# Altium project AD8428_shield.PrjPcb
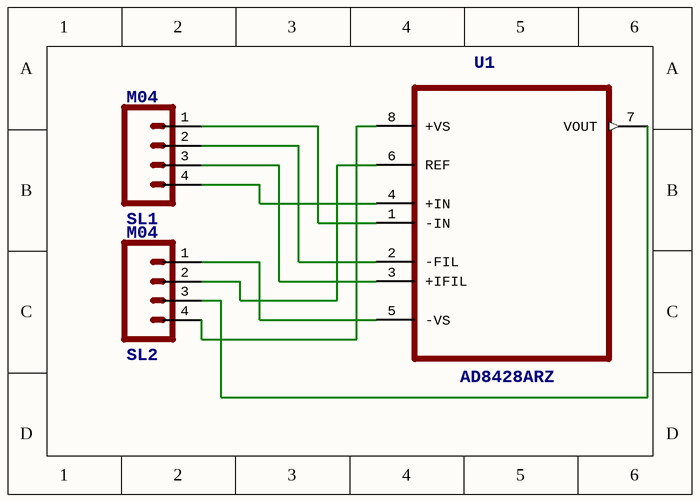
[diagram p0: AD8428_shield.SchDoc]
1 sheet, 3 parts. Net scope: global (net labels, ports and power ports of the same name join across sheets).
Board file: AD8428_shield.PcbDoc

## Sheet AD8428_shield.SchDoc
size 89 x 63 mm

### Parts
SL1  M04  [04P]
SL2  M04  [04P]
U1  AD8428ARZ  [SOIC127P600X175-8N]

### Nets
NetSL1_1: SL1.1 U1.1(-IN)
NetSL1_2: SL1.2 U1.2(-FIL)
NetSL1_3: SL1.3 U1.3(+IFIL)
NetSL1_4: SL1.4 U1.4(+IN)
NetSL2_1: SL2.1 U1.5(-VS)
NetSL2_2: SL2.2 U1.6(REF)
NetSL2_3: SL2.3 U1.7(VOUT)
NetSL2_4: SL2.4 U1.8(+VS)

### Library data of the parts
SL1 SL2 = M04: <b>AMP QUICK CONNECTOR</b>; OC_FARNELL: unknown; OC_NEWARK: unknown
U1 = AD8428ARZ: Instrumentation Amplifier; MPN: AD8428ARZ; OC_FARNELL: 2065944; OC_NEWARK: 67T0293; PACKAGE: SOIC-8; SUPPLIER: Analog Devices